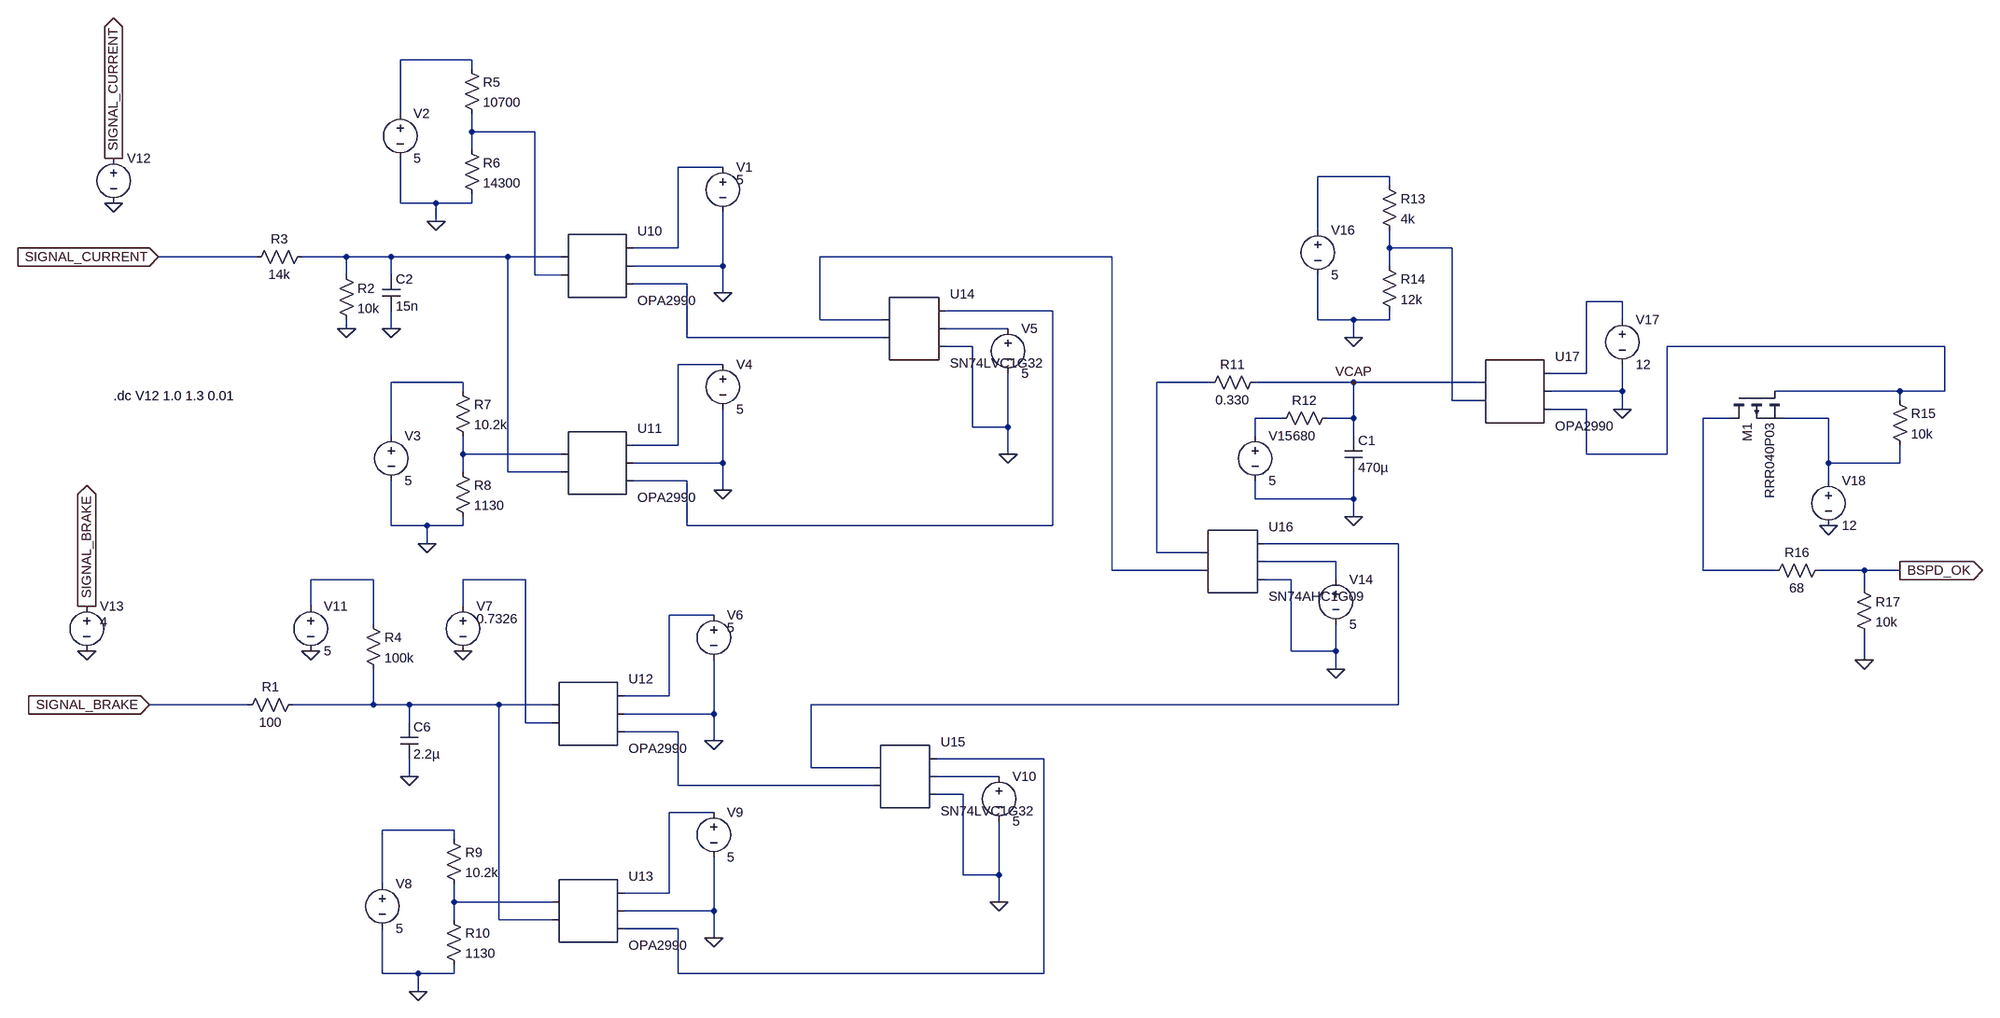
[diagram p0: schematic BSPD_dc.asc]
BSPD_dc.asc, the LTspice schematic file:
Version 4
SHEET 1 2972 1620
WIRE 224 -64 96 -64
WIRE 224 -48 224 -64
WIRE 96 32 96 -64
WIRE 224 64 224 32
WIRE 336 64 224 64
WIRE 224 96 224 64
WIRE 672 128 592 128
WIRE 1888 144 1760 144
WIRE 1888 160 1888 144
WIRE 96 192 96 112
WIRE 160 192 96 192
WIRE 224 192 224 176
WIRE 224 192 160 192
WIRE 160 224 160 192
WIRE 1760 240 1760 144
WIRE 592 272 592 128
WIRE 592 272 512 272
WIRE 1888 272 1888 240
WIRE 2000 272 1888 272
WIRE -160 288 -336 288
WIRE 0 288 -80 288
WIRE 80 288 0 288
WIRE 288 288 80 288
WIRE 384 288 288 288
WIRE 1392 288 864 288
WIRE 672 304 672 208
WIRE 672 304 512 304
WIRE 1888 304 1888 272
WIRE 0 320 0 288
WIRE 80 320 80 288
WIRE 336 320 336 64
WIRE 384 320 336 320
WIRE 608 336 512 336
WIRE 672 352 672 304
WIRE 2304 368 2240 368
WIRE 1280 384 1088 384
WIRE 864 400 864 288
WIRE 976 400 864 400
WIRE 1760 400 1760 320
WIRE 1824 400 1760 400
WIRE 1888 400 1888 384
WIRE 1888 400 1824 400
WIRE 2304 400 2304 368
WIRE 0 416 0 400
WIRE 80 416 80 384
WIRE 1200 416 1088 416
WIRE 608 432 608 336
WIRE 976 432 608 432
WIRE 1824 432 1824 400
WIRE 1136 448 1088 448
WIRE 2880 448 2384 448
WIRE 672 480 592 480
WIRE 2240 496 2240 368
WIRE 2240 496 2176 496
WIRE 208 512 80 512
WIRE 1568 512 1472 512
WIRE 1824 512 1648 512
WIRE 2048 512 1824 512
WIRE 208 528 208 512
WIRE 2304 528 2304 480
WIRE 2304 528 2176 528
WIRE 2800 528 2576 528
WIRE 2880 528 2880 448
WIRE 2880 528 2800 528
WIRE 2000 544 2000 272
WIRE 2048 544 2000 544
WIRE 2800 544 2800 528
WIRE 2240 560 2176 560
WIRE 2304 560 2304 528
WIRE 1696 576 1648 576
WIRE 1824 576 1824 512
WIRE 1824 576 1776 576
WIRE 2496 576 2448 576
WIRE 2672 576 2592 576
WIRE 1136 592 1136 448
WIRE 1200 592 1200 496
WIRE 1200 592 1136 592
WIRE 80 608 80 512
WIRE 1648 608 1648 576
WIRE 1824 608 1824 576
WIRE 592 624 592 480
WIRE 592 624 512 624
WIRE 208 640 208 608
WIRE 384 640 208 640
WIRE 1200 640 1200 592
WIRE 2240 640 2240 560
WIRE 2384 640 2384 448
WIRE 2384 640 2240 640
WIRE 672 656 672 560
WIRE 672 656 512 656
WIRE 2672 656 2672 576
WIRE 2800 656 2800 624
WIRE 2800 656 2672 656
WIRE 208 672 208 640
WIRE 288 672 288 288
WIRE 384 672 288 672
WIRE 608 688 512 688
WIRE 2672 688 2672 656
WIRE 672 704 672 656
WIRE 1648 720 1648 688
WIRE 1824 720 1824 672
WIRE 1824 720 1648 720
WIRE 1824 752 1824 720
WIRE 80 768 80 688
WIRE 144 768 80 768
WIRE 208 768 208 752
WIRE 208 768 144 768
WIRE 608 768 608 688
WIRE 1280 768 1280 384
WIRE 1280 768 608 768
WIRE 144 800 144 768
WIRE 1904 800 1664 800
WIRE 1472 816 1472 512
WIRE 1552 816 1472 816
WIRE 1792 832 1664 832
WIRE 1392 848 1392 288
WIRE 1552 848 1392 848
WIRE 2448 848 2448 576
WIRE 2576 848 2448 848
WIRE 2736 848 2656 848
WIRE 2800 848 2736 848
WIRE 48 864 -64 864
WIRE 320 864 208 864
WIRE 1712 864 1664 864
WIRE 1792 864 1792 832
WIRE 2736 880 2736 848
WIRE -64 912 -64 864
WIRE 208 912 208 864
WIRE 656 928 576 928
WIRE 48 944 48 864
WIRE 1712 992 1712 864
WIRE 1792 992 1792 944
WIRE 1792 992 1712 992
WIRE 2736 1008 2736 960
WIRE 1792 1024 1792 992
WIRE 576 1072 576 928
WIRE 576 1072 496 1072
WIRE -176 1088 -352 1088
WIRE 48 1088 48 1024
WIRE 48 1088 -96 1088
WIRE 112 1088 48 1088
WIRE 272 1088 112 1088
WIRE 368 1088 272 1088
WIRE 1904 1088 1904 800
WIRE 1904 1088 848 1088
WIRE 656 1104 656 1008
WIRE 656 1104 496 1104
WIRE 112 1120 112 1088
WIRE 320 1120 320 864
WIRE 368 1120 320 1120
WIRE 592 1136 496 1136
WIRE 656 1152 656 1104
WIRE 1264 1184 1072 1184
WIRE 848 1200 848 1088
WIRE 960 1200 848 1200
WIRE 112 1216 112 1184
WIRE 1184 1216 1072 1216
WIRE 592 1232 592 1136
WIRE 960 1232 592 1232
WIRE 1120 1248 1072 1248
WIRE 656 1280 576 1280
WIRE 192 1312 64 1312
WIRE 192 1328 192 1312
WIRE 1120 1392 1120 1248
WIRE 1184 1392 1184 1296
WIRE 1184 1392 1120 1392
WIRE 64 1408 64 1312
WIRE 576 1424 576 1280
WIRE 576 1424 496 1424
WIRE 192 1440 192 1408
WIRE 368 1440 192 1440
WIRE 1184 1440 1184 1392
WIRE 656 1456 656 1360
WIRE 656 1456 496 1456
WIRE 192 1472 192 1440
WIRE 272 1472 272 1088
WIRE 368 1472 272 1472
WIRE 592 1488 496 1488
WIRE 656 1504 656 1456
WIRE 64 1568 64 1488
WIRE 128 1568 64 1568
WIRE 192 1568 192 1552
WIRE 192 1568 128 1568
WIRE 592 1568 592 1488
WIRE 1264 1568 1264 1184
WIRE 1264 1568 592 1568
WIRE 128 1600 128 1568
FLAG 672 352 0
FLAG 80 416 0
FLAG 0 416 0
FLAG 672 704 0
FLAG 1200 640 0
FLAG 656 1152 0
FLAG 112 1216 0
FLAG 656 1504 0
FLAG 1184 1440 0
FLAG 208 992 0
FLAG -64 992 0
FLAG -336 288 SIGNAL_CURRENT
IOPIN -336 288 In
FLAG -352 1088 SIGNAL_BRAKE
IOPIN -352 1088 In
FLAG -416 192 0
FLAG -416 112 SIGNAL_CURRENT
IOPIN -416 112 Out
FLAG -464 992 0
FLAG -464 912 SIGNAL_BRAKE
IOPIN -464 912 Out
FLAG 160 224 0
FLAG 144 800 0
FLAG 128 1600 0
FLAG 1792 1024 0
FLAG 1824 752 0
FLAG 1824 432 0
FLAG 2304 560 0
FLAG 2672 768 0
FLAG 2800 848 BSPD_OK
IOPIN 2800 848 Out
FLAG 2736 1008 0
FLAG 1824 512 VCAP
DATAFLAG 1136 592 ""
SYMBOL voltage 672 112 R0
WINDOW 3 24 38 Left 2
SYMATTR Value 5
SYMATTR InstName V1
SYMBOL res -64 272 R90
WINDOW 0 0 56 VBottom 2
WINDOW 3 32 56 VTop 2
SYMATTR InstName R3
SYMATTR Value 14k
SYMBOL cap 64 320 R0
SYMATTR InstName C2
SYMATTR Value 15n
SYMBOL voltage 672 464 R0
SYMATTR InstName V4
SYMATTR Value 5
SYMBOL voltage 1200 400 R0
SYMATTR InstName V5
SYMATTR Value 5
SYMBOL voltage 656 912 R0
WINDOW 3 24 38 Left 2
SYMATTR Value 5
SYMATTR InstName V6
SYMBOL voltage 208 896 R0
WINDOW 3 24 38 Left 2
SYMATTR Value 0.7326
SYMATTR InstName V7
SYMBOL res -80 1072 R90
WINDOW 0 0 56 VBottom 2
WINDOW 3 32 56 VTop 2
SYMATTR InstName R1
SYMATTR Value 100
SYMBOL cap 96 1120 R0
SYMATTR InstName C6
SYMATTR Value 2.2µ
SYMBOL voltage 656 1264 R0
SYMATTR InstName V9
SYMATTR Value 5
SYMBOL voltage 1184 1200 R0
SYMATTR InstName V10
SYMATTR Value 5
SYMBOL voltage -64 896 R0
SYMATTR InstName V11
SYMATTR Value 5
SYMBOL voltage -416 96 R0
WINDOW 123 0 0 Left 0
WINDOW 39 0 0 Left 0
SYMATTR InstName V12
SYMATTR Value ""
SYMBOL res -16 304 R0
SYMATTR InstName R2
SYMATTR Value 10k
SYMBOL voltage -464 896 R0
WINDOW 123 0 0 Left 0
WINDOW 39 0 0 Left 0
WINDOW 3 24 44 Left 2
SYMATTR InstName V13
SYMATTR Value 4
SYMBOL res 32 928 R0
SYMATTR InstName R4
SYMATTR Value 100k
SYMBOL voltage 96 16 R0
SYMATTR InstName V2
SYMATTR Value 5
SYMBOL res 208 -64 R0
SYMATTR InstName R5
SYMATTR Value 10700
SYMBOL res 208 80 R0
SYMATTR InstName R6
SYMATTR Value 14300
SYMBOL voltage 80 592 R0
SYMATTR InstName V3
SYMATTR Value 5
SYMBOL res 192 512 R0
SYMATTR InstName R7
SYMATTR Value 10.2k
SYMBOL res 192 656 R0
SYMATTR InstName R8
SYMATTR Value 1130
SYMBOL voltage 64 1392 R0
SYMATTR InstName V8
SYMATTR Value 5
SYMBOL res 176 1312 R0
SYMATTR InstName R9
SYMATTR Value 10.2k
SYMBOL res 176 1456 R0
SYMATTR InstName R10
SYMATTR Value 1130
SYMBOL voltage 1792 848 R0
SYMATTR InstName V14
SYMATTR Value 5
SYMBOL voltage 1648 592 R0
SYMATTR InstName V15
SYMATTR Value 5
SYMBOL res 1664 496 R90
WINDOW 0 0 56 VBottom 2
WINDOW 3 32 56 VTop 2
SYMATTR InstName R11
SYMATTR Value 0.330
SYMBOL res 1680 592 R270
WINDOW 0 32 56 VTop 2
WINDOW 3 0 56 VBottom 2
SYMATTR InstName R12
SYMATTR Value 680
SYMBOL cap 1808 608 R0
SYMATTR InstName C1
SYMATTR Value 470µ
SYMBOL voltage 1760 224 R0
SYMATTR InstName V16
SYMATTR Value 5
SYMBOL res 1872 144 R0
SYMATTR InstName R13
SYMATTR Value 4k
SYMBOL res 1872 288 R0
SYMATTR InstName R14
SYMATTR Value 12k
SYMBOL voltage 2304 384 R0
SYMATTR InstName V17
SYMATTR Value 12
SYMBOL voltage 2672 672 R0
SYMATTR InstName V18
SYMATTR Value 12
SYMBOL res 2784 528 R0
SYMATTR InstName R15
SYMATTR Value 10k
SYMBOL res 2672 832 R90
WINDOW 0 0 56 VBottom 2
WINDOW 3 32 56 VTop 2
SYMATTR InstName R16
SYMATTR Value 68
SYMBOL AutoGenerated\\OPA2990 448 304 R0
SYMATTR InstName U10
SYMBOL AutoGenerated\\OPA2990 448 656 R0
SYMATTR InstName U11
SYMBOL AutoGenerated\\OPA2990 432 1104 R0
SYMATTR InstName U12
SYMBOL AutoGenerated\\OPA2990 432 1456 R0
SYMATTR InstName U13
SYMBOL AutoGenerated\\SN74LVC1G32 1024 416 R0
SYMATTR InstName U14
SYMBOL AutoGenerated\\SN74LVC1G32 1008 1216 R0
SYMATTR InstName U15
SYMBOL AutoGenerated\\SN74AHC1G09 1600 832 R0
SYMATTR InstName U16
SYMBOL AutoGenerated\\OPA2990 2112 528 R0
SYMATTR InstName U17
SYMBOL pmos 2496 528 M90
SYMATTR InstName M1
SYMATTR Value RRR040P03
SYMBOL res 2720 864 R0
SYMATTR InstName R17
SYMATTR Value 10k
TEXT -416 536 Left 2 !.dc V12 1.0 1.3 0.01

The netlist it stands for:
* BSPD_dc.asc
V1 N003 0 5
R3 N006 SIGNAL_CURRENT 14k
C2 N006 0 15n
V4 N013 0 5
V5 N011 0 5
V6 N024 0 5
V7 N023 0 0.7326
R1 N025 SIGNAL_BRAKE 100
C6 N025 0 2.2µ
V9 N029 0 5
V10 N028 0 5
V11 N022 0 5
V12 SIGNAL_CURRENT 0
R2 N006 0 10k
V13 SIGNAL_BRAKE 0 4
R4 N022 N025 100k
V2 N001 0 5
R5 N001 N002 10700
R6 N002 0 14300
V3 N014 0 5
R7 N014 N019 10.2k
R8 N019 0 1130
V8 N030 0 5
R9 N030 N031 10.2k
R10 N031 0 1130
V14 N021 0 5
V15 N016 0 5
R11 VCAP N015 0.330
R12 N016 VCAP 680
C1 VCAP 0 470µ
V16 N004 0 5
R13 N004 N005 4k
R14 N005 0 12k
V17 N009 0 12
V18 N018 0 12
R15 N012 N018 10k
R16 BSPD_OK N017 68
* U10: OPA2990 (symbol AutoGenerated\OPA2990 not available, pins judged from their places): pin1=N006 pin2=N002 pin3=N003 pin4=0 pin5=N008
* U11: OPA2990 (symbol AutoGenerated\OPA2990 not available, pins judged from their places): pin1=N019 pin2=N006 pin3=N013 pin4=0 pin5=N010
* U12: OPA2990 (symbol AutoGenerated\OPA2990 not available, pins judged from their places): pin1=N025 pin2=N023 pin3=N024 pin4=0 pin5=N026
* U13: OPA2990 (symbol AutoGenerated\OPA2990 not available, pins judged from their places): pin1=N031 pin2=N025 pin3=N029 pin4=0 pin5=N027
* U14: SN74LVC1G32 (symbol AutoGenerated\SN74LVC1G32 not available, pins judged from their places): pin1=N007 pin2=N008 pin3=N010 pin4=N011 pin5=0
* U15: SN74LVC1G32 (symbol AutoGenerated\SN74LVC1G32 not available, pins judged from their places): pin1=N020 pin2=N026 pin3=N027 pin4=N028 pin5=0
* U16: SN74AHC1G09 (symbol AutoGenerated\SN74AHC1G09 not available, pins judged from their places): pin1=N015 pin2=N007 pin3=N020 pin4=N021 pin5=0
* U17: OPA2990 (symbol AutoGenerated\OPA2990 not available, pins judged from their places): pin1=VCAP pin2=N005 pin3=N009 pin4=0 pin5=N012
M1 N017 N012 N018 N018 RRR040P03
R17 BSPD_OK 0 10k
.model NMOS NMOS
.model PMOS PMOS
.lib standard.mos
.dc V12 1.0 1.3 0.01
.backanno
.end